# EAGLE design LUZES_18Fv3 (EAGLE 5.10)
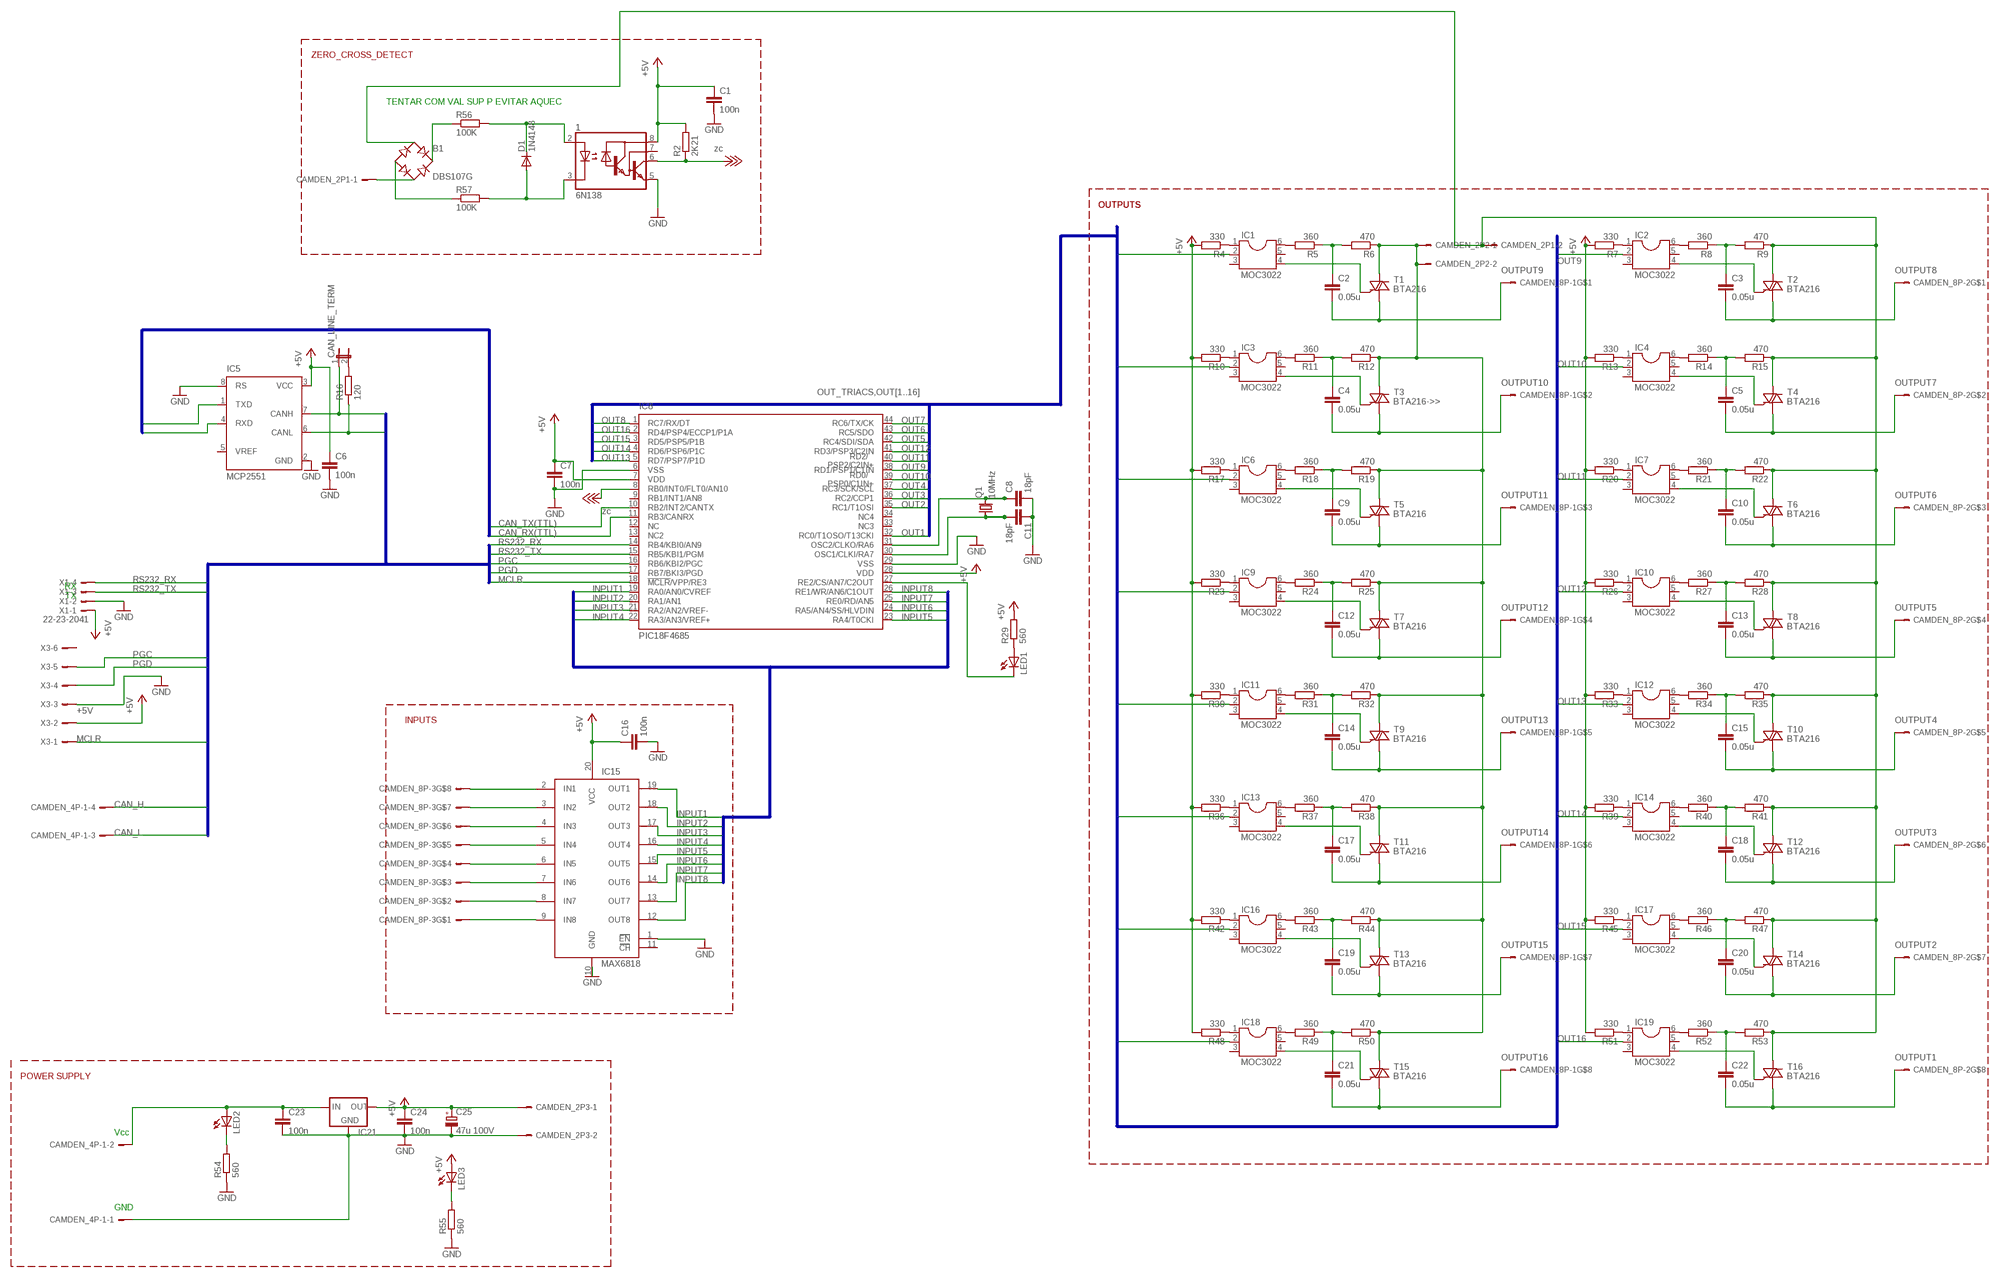
[diagram p0: schematic, sheet 1]

## Parts
1  6N138  6N138SMD  [DIL8-SMD]
B1  DBS107G  [DBS]
C1  100n  C-EUC0805  [C0805]
C2  0.05u  C-EU102-043X133  [C102-043X133]
C3  0.05u  C-EU102-043X133  [C102-043X133]
C4  0.05u  C-EU102-043X133  [C102-043X133]
C5  0.05u  C-EU102-043X133  [C102-043X133]
C6  100n  C-EUC0805  [C0805]
C7  100n  C-EUC0805  [C0805]
C8  18pF  C-EUC0805  [C0805]
C9  0.05u  C-EU102-043X133  [C102-043X133]
C10  0.05u  C-EU102-043X133  [C102-043X133]
C11  18pF  C-EUC0805  [C0805]
C12  0.05u  C-EU102-043X133  [C102-043X133]
C13  0.05u  C-EU102-043X133  [C102-043X133]
C14  0.05u  C-EU102-043X133  [C102-043X133]
C15  0.05u  C-EU102-043X133  [C102-043X133]
C16  100n  C-EUC0805  [C0805]
C17  0.05u  C-EU102-043X133  [C102-043X133]
C18  0.05u  C-EU102-043X133  [C102-043X133]
C19  0.05u  C-EU102-043X133  [C102-043X133]
C20  0.05u  C-EU102-043X133  [C102-043X133]
C21  0.05u  C-EU102-043X133  [C102-043X133]
C22  0.05u  C-EU102-043X133  [C102-043X133]
C23  100n  C-EUC0805  [C0805]
C24  100n  C-EUC0805  [C0805]
C25  47u 100V  CPOL-EUE5-13  [E5-13]
CAMDEN_2P1  CTB9550-2508  [508_2]
CAMDEN_2P2  CTB9550-2508  [508_2]
CAMDEN_2P3  CTB9550-2508  [508_2]
CAMDEN_4P-1  CTB9550-4508  [508_4]
CAMDEN_8P-1  CTB9550-8508  [508_8]
CAMDEN_8P-2  CTB9550-8508  [508_8]
CAMDEN_8P-3  CTB9550-8508  [508_8]
CAN_LINE_TERM  JP1E  [JP1]
D1  1N4148  [DO35-10]
IC1  MOC3022  DIL6  [DIL06]
IC2  MOC3022  DIL6  [DIL06]
IC3  MOC3022  DIL6  [DIL06]
IC4  MOC3022  DIL6  [DIL06]
IC5  MCP2551  PCA82C250T  [SO8]
IC6  MOC3022  DIL6  [DIL06]
IC7  MOC3022  DIL6  [DIL06]
IC8  PIC18F4685  PIC18F4682_85TQFP  [TQFP44@1]
IC9  MOC3022  DIL6  [DIL06]
IC10  MOC3022  DIL6  [DIL06]
IC11  MOC3022  DIL6  [DIL06]
IC12  MOC3022  DIL6  [DIL06]
IC13  MOC3022  DIL6  [DIL06]
IC14  MOC3022  DIL6  [DIL06]
IC15  MAX6818  MAX6818SMALL  [SSOP20_SMALL]
IC16  MOC3022  DIL6  [DIL06]
IC17  MOC3022  DIL6  [DIL06]
IC18  MOC3022  DIL6  [DIL06]
IC19  MOC3022  DIL6  [DIL06]
IC21  78XXS  [78XXS]
LED1  LEDCHIP-LED0805  [CHIP-LED0805]
LED2  LEDCHIP-LED0805  [CHIP-LED0805]
LED3  LEDCHIP-LED0805  [CHIP-LED0805]
Q1  10MHz  CRYSTALHC49U-V  [HC49U-V]
R2  2K21  R-EU_M0805  [M0805]
R4  330  R-EU_M0805  [M0805]
R5  360  R-EU_R0805  [R0805]
R6  470  R-EU_R0805  [R0805]
R7  330  R-EU_M0805  [M0805]
R8  360  R-EU_R0805  [R0805]
R9  470  R-EU_R0805  [R0805]
R10  330  R-EU_M0805  [M0805]
R11  360  R-EU_R0805  [R0805]
R12  470  R-EU_R0805  [R0805]
R13  330  R-EU_M0805  [M0805]
R14  360  R-EU_R0805  [R0805]
R15  470  R-EU_R0805  [R0805]
R16  120  R-EU_M0805  [M0805]
R17  330  R-EU_M0805  [M0805]
R18  360  R-EU_R0805  [R0805]
R19  470  R-EU_R0805  [R0805]
R20  330  R-EU_M0805  [M0805]
R21  360  R-EU_R0805  [R0805]
R22  470  R-EU_R0805  [R0805]
R23  330  R-EU_M0805  [M0805]
R24  360  R-EU_R0805  [R0805]
R25  470  R-EU_R0805  [R0805]
R26  330  R-EU_M0805  [M0805]
R27  360  R-EU_R0805  [R0805]
R28  470  R-EU_R0805  [R0805]
R29  560  R-EU_R0805  [R0805]
R30  330  R-EU_M0805  [M0805]
R31  360  R-EU_R0805  [R0805]
R32  470  R-EU_R0805  [R0805]
R33  330  R-EU_M0805  [M0805]
R34  360  R-EU_R0805  [R0805]
R35  470  R-EU_R0805  [R0805]
R36  330  R-EU_M0805  [M0805]
R37  360  R-EU_R0805  [R0805]
R38  470  R-EU_R0805  [R0805]
R39  330  R-EU_M0805  [M0805]
R40  360  R-EU_R0805  [R0805]
R41  470  R-EU_R0805  [R0805]
R42  330  R-EU_M0805  [M0805]
R43  360  R-EU_R0805  [R0805]
R44  470  R-EU_R0805  [R0805]
R45  330  R-EU_M0805  [M0805]
R46  360  R-EU_R0805  [R0805]
R47  470  R-EU_R0805  [R0805]
R48  330  R-EU_M0805  [M0805]
R49  360  R-EU_R0805  [R0805]
R50  470  R-EU_R0805  [R0805]
R51  330  R-EU_M0805  [M0805]
R52  360  R-EU_R0805  [R0805]
R53  470  R-EU_R0805  [R0805]
R54  560  R-EU_R0805  [R0805]
R55  560  R-EU_R0805  [R0805]
R56  100K  R-EU_R2512  [R2512]
R57  100K  R-EU_R2512  [R2512]
T1  BTA216  TIC225S  [TO220DS]
T2  BTA216  TIC225S  [TO220DS]
T3  BTA216->>  TIC225S  [TO220DS]
T4  BTA216  TIC225S  [TO220DS]
T5  BTA216  TIC225S  [TO220DS]
T6  BTA216  TIC225S  [TO220DS]
T7  BTA216  TIC225S  [TO220DS]
T8  BTA216  TIC225S  [TO220DS]
T9  BTA216  TIC225S  [TO220DS]
T10  BTA216  TIC225S  [TO220DS]
T11  BTA216  TIC225S  [TO220DS]
T12  BTA216  TIC225S  [TO220DS]
T13  BTA216  TIC225S  [TO220DS]
T14  BTA216  TIC225S  [TO220DS]
T15  BTA216  TIC225S  [TO220DS]
T16  BTA216  TIC225S  [TO220DS]
X1  22-23-2041  [22-23-2041]
X3  22-23-2061  [22-23-2061]

## Nets
+5V: 1.8(VCC) C1.1 C6.1 C7.1 C16.1 C24.1 C25.+ CAMDEN_2P3.P$1 IC5.3(VCC) IC8.7(VDD) IC8.28(VDD) IC15.20(VCC) IC21.OUT LED3.A R2.2 R4.2 R7.2 R10.2 R13.2 R17.2 R20.2 R23.2 R26.2 R29.2 R30.2 R33.2 R36.2 R39.2 R42.2 R45.2 R48.2 R51.2 X1.1 X3.2
+18V: 1.6(VO) IC8.8(RB0/INT0/FLT0/AN10) R2.1 ; supply symbol labelled zc
CAN_H: CAMDEN_4P-1.P$4 CAN_LINE_TERM.1 IC5.7(CANH)
CAN_L: CAMDEN_4P-1.P$3 IC5.6(CANL) R16.1
CAN_RX(TTL): IC5.4(RXD) IC8.11(RB3/CANRX)
CAN_TX(TTL): IC5.1(TXD) IC8.10(RB2/INT2/CANTX)
GND: 1.5(GND) C1.2 C6.2 C7.2 C8.2 C11.1 C16.2 C23.2 C24.2 C25.- CAMDEN_2P3.P$2 CAMDEN_4P-1.P$1 IC5.2(GND) IC5.8(RS) IC8.6(VSS) IC8.29(VSS) IC15.1(EN) IC15.10(GND) IC21.GND R54.1 R55.1 X1.2 X3.3
INPUT1: IC8.19(RA0/AN0/CVREF) IC15.19(OUT1)
INPUT2: IC8.20(RA1/AN1) IC15.18(OUT2)
INPUT3: IC8.21(RA2/AN2/VREF-) IC15.17(OUT3)
INPUT4: IC8.22(RA3/AN3/VREF+) IC15.16(OUT4)
INPUT5: IC8.23(RA4/T0CKI) IC15.15(OUT5)
INPUT6: IC8.24(RA5/AN4/SS/HLVDIN) IC15.14(OUT6)
INPUT7: IC8.25(RE0/RD/AN5) IC15.13(OUT7)
INPUT8: IC8.26(RE1/WR/AN6/C1OUT) IC15.12(OUT8)
MCLR: IC8.18(!MCLR!/VPP/RE3) X3.1
N$1: C8.1 IC8.31(OSC2/CLKO/RA6) Q1.2
N$2: C11.2 IC8.30(OSC1/CLKI/RA7) Q1.1
N$3: B1.AC1 CAMDEN_2P1.P$2 R9.1 R15.1 R22.1 R28.1 R35.1 R41.1 R47.1 R53.1 T2.A2 T4.A2 T6.A2 T8.A2 T10.A2 T12.A2 T14.A2 T16.A2
N$4: B1.AC2 CAMDEN_2P1.P$1
N$5: B1.+ R56.1
N$6: CAMDEN_8P-3.P$9 IC15.2(IN1)
N$7: CAMDEN_8P-3.P$7 IC15.3(IN2)
N$8: CAMDEN_8P-3.P$1 IC15.9(IN8)
N$9: CAMDEN_8P-3.P$2 IC15.8(IN7)
N$10: CAMDEN_8P-3.P$3 IC15.7(IN6)
N$11: CAMDEN_8P-3.P$6 IC15.4(IN3)
N$12: CAMDEN_8P-3.P$5 IC15.5(IN4)
N$13: CAMDEN_8P-3.P$4 IC15.6(IN5)
N$16: IC3.6 R11.2
N$17: IC6.6 R18.2
N$18: IC9.6 R24.2
N$20: IC2.6 R8.2
N$25: IC4.6 R14.2
N$27: IC11.6 R31.2
N$29: IC13.6 R37.2
N$30: IC16.6 R43.2
N$33: IC17.6 R46.2
N$34: IC14.6 R40.2
N$35: IC12.6 R34.2
N$36: IC10.6 R27.2
N$37: IC7.6 R21.2
N$38: LED1.A R29.1
N$39: IC8.27(RE2/CS/AN7/C2OUT) LED1.C
N$40: IC18.6 R49.2
N$41: IC19.6 R52.2
N$46: CAMDEN_2P2.P$1 CAMDEN_2P2.P$2 R6.1 R12.1 R19.1 R25.1 R32.1 R38.1 R44.1 R50.1 T1.A2 T3.A2 T5.A2 T7.A2 T9.A2 T11.A2 T13.A2 T15.A2
N$111: C23.1 CAMDEN_4P-1.P$2 IC21.IN LED2.A
N$112: LED2.C R54.2
N$115: LED3.C R55.2
N$116: 1.2(A) D1.C R56.2
N$117: B1.- R57.1
N$118: 1.3(C) D1.A R57.2
N$119: IC1.1 R4.1
N$120: IC1.6 R5.2
N$121: C2.1 R5.1 R6.2
N$123: IC1.4 T1.G
N$125: IC3.1 R10.1
N$127: C4.1 R11.1 R12.2
N$129: IC3.4 T3.G
N$131: IC6.1 R17.1
N$133: C9.1 R18.1 R19.2
N$135: IC6.4 T5.G
N$137: IC9.1 R23.1
N$139: C12.1 R24.1 R25.2
N$141: IC9.4 T7.G
N$143: IC11.1 R30.1
N$145: C14.1 R31.1 R32.2
N$147: IC11.4 T9.G
N$149: IC13.1 R36.1
N$151: C17.1 R37.1 R38.2
N$153: IC13.4 T11.G
N$155: IC16.1 R42.1
N$157: C19.1 R43.1 R44.2
N$159: IC16.4 T13.G
N$161: IC18.1 R48.1
N$163: C21.1 R49.1 R50.2
N$165: IC18.4 T15.G
N$168: IC2.1 R7.1
N$170: C3.1 R8.1 R9.2
N$172: IC2.4 T2.G
N$174: IC4.1 R13.1
N$176: C5.1 R14.1 R15.2
N$178: IC4.4 T4.G
N$180: IC7.1 R20.1
N$182: C10.1 R21.1 R22.2
N$184: IC7.4 T6.G
N$186: IC10.1 R26.1
N$188: C13.1 R27.1 R28.2
N$190: IC10.4 T8.G
N$192: IC12.1 R33.1
N$194: C15.1 R34.1 R35.2
N$196: IC12.4 T10.G
N$198: IC14.1 R39.1
N$200: C18.1 R40.1 R41.2
N$202: IC14.4 T12.G
N$204: IC17.1 R45.1
N$206: C20.1 R46.1 R47.2
N$208: IC17.4 T14.G
N$210: IC19.1 R51.1
N$212: C22.1 R52.1 R53.2
N$214: IC19.4 T16.G
N$217: CAN_LINE_TERM.2 R16.2
OUT1: IC8.32(RC0/T1OSO/T13CKI) IC18.2
OUT2: IC8.35(RC1/T1OSI) IC16.2
OUT3: IC8.36(RC2/CCP1) IC13.2
OUT4: IC8.37(RC3/SCK/SCL) IC11.2
OUT5: IC8.42(RC4/SDI/SDA) IC9.2
OUT6: IC6.2 IC8.43(RC5/SDO)
OUT7: IC3.2 IC8.44(RC6/TX/CK)
OUT8: IC1.2 IC8.1(RC7/RX/DT)
OUT9: IC2.2 IC8.38(RD1/PSP1/C1IN)
OUT10: IC4.2 IC8.39(RD0/
PSP0/C1IN+)
OUT11: IC7.2 IC8.40(RD2/
PSP2/C2IN+)
OUT12: IC8.41(RD3/PSP3/C2IN) IC10.2
OUT13: IC8.5(RD7/PSP7/P1D) IC12.2
OUT14: IC8.4(RD6/PSP6/P1C) IC14.2
OUT15: IC8.3(RD5/PSP5/P1B) IC17.2
OUT16: IC8.2(RD4/PSP4/ECCP1/P1A) IC19.2
OUTPUT1: C22.2 CAMDEN_8P-2.P$9 T16.A1
OUTPUT2: C20.2 CAMDEN_8P-2.P$7 T14.A1
OUTPUT3: C18.2 CAMDEN_8P-2.P$6 T12.A1
OUTPUT4: C15.2 CAMDEN_8P-2.P$5 T10.A1
OUTPUT5: C13.2 CAMDEN_8P-2.P$4 T8.A1
OUTPUT6: C10.2 CAMDEN_8P-2.P$3 T6.A1
OUTPUT7: C5.2 CAMDEN_8P-2.P$2 T4.A1
OUTPUT8: C3.2 CAMDEN_8P-2.P$1 T2.A1
OUTPUT9: C2.2 CAMDEN_8P-1.P$1 T1.A1
OUTPUT10: C4.2 CAMDEN_8P-1.P$2 T3.A1
OUTPUT11: C9.2 CAMDEN_8P-1.P$3 T5.A1
OUTPUT12: C12.2 CAMDEN_8P-1.P$4 T7.A1
OUTPUT13: C14.2 CAMDEN_8P-1.P$5 T9.A1
OUTPUT14: C17.2 CAMDEN_8P-1.P$6 T11.A1
OUTPUT15: C19.2 CAMDEN_8P-1.P$7 T13.A1
OUTPUT16: C21.2 CAMDEN_8P-1.P$9 T15.A1
PGC: IC8.16(RB6/KBI2/PGC) X3.5
PGD: IC8.17(RB7/BKI3/PGD) X3.4
RS232_RX: IC8.14(RB4/KBI0/AN9) X1.4
RS232_TX: IC8.15(RB5/KBI1/PGM) X1.3
Unconnected: 1.7(VB) IC1.3 IC1.5 IC2.3 IC2.5 IC3.3 IC3.5 IC4.3 IC4.5 IC5.5(VREF) IC6.3 IC6.5 IC7.3 IC7.5 IC8.9(RB1/INT1/AN8) IC8.12(NC) IC8.13(NC2) IC8.33(NC3) IC8.34(NC4) IC9.3 IC9.5 IC10.3 IC10.5 IC11.3 IC11.5 IC12.3 IC12.5 IC13.3 IC13.5 IC14.3 IC14.5 IC15.11(CH) IC16.3 IC16.5 IC17.3 IC17.5 IC18.3 IC18.5 IC19.3 IC19.5 X3.6

## Buses
OUT_TRIACS,OUT[1..16]
INPUTS,INPUT[1..8]
EXT_CON,+12,GND,RS232_RX,RS232_TX,CAN_L,CAN_H,MCLR,PGD,PGC
CAN_TX(TTL),CAN_RX(TTL)

## Notes on the sheet
- ZERO_CROSS_DETECT
- TENTAR COM VAL SUP P EVITAR AQUEC
- OUTPUTS | OUTPUTS
- RX
- TX
- INPUTS
- POWER SUPPLY
- Vcc
- GND

## Library data of the parts
1 = optocoupler:6N138: MOTOROLA OPTO COUPLER
B1 = rectifier:DB?*G: Single Phase 1.0 AMP Glass Passivated Bridge Rectifier Taiwan Semiconductor Co.,Ltd. - TSC Source: http://www.taiwansemi.com/TSCbig5/ezcatfiles/cust/img/img/db101g.pdf http://www.ts.com.tw/db/pictures/modules/PDT/PDT060207001/DBLS201G.pdf
C1-C24 = rcl:C-EU: CAPACITOR, European symbol
C25 = rcl:CPOL-EU: POLARIZED CAPACITOR, European symbol
CAMDEN_2P1-CAMDEN_2P3 = mycomponents:CTB9550-2
CAMDEN_4P-1 = mycomponents:CTB9550-4
CAMDEN_8P-1-CAMDEN_8P-3 = mycomponents:CTB9550-8
CAN_LINE_TERM = jumper:JP1E: JUMPER
D1 = diode:1N4148: DIODE high speed (Philips)
IC1-IC4 IC6 IC7 IC9-IC14 IC16-IC19 = ic-package:DIL6: Dual In Line
IC5 = micro-philips:PCA82C250: CAN CONTROLLER INTERFACE
IC8 = microchip:PIC18F4682_85TQFP
IC15 = maxim:MAX6818
IC21 = v-reg:78XXS: VOLTAGE REGULATOR
LED1-LED3 = led:LED: LED OSRAM: - CHIPLED LG R971, LG N971, LY N971, LG Q971, LY Q971, LO R971, LY R971 LH N974, LH R974 LS Q976, LO Q976, LY Q976 LO Q996 - Hyper CHIPLED LW Q18S LB Q993, LB Q99A, LB R99A - SideLED LS A670, LO A670, LY A670, LG A670, LP A670 LB A673, LV A673, LT A673, LW A673 LH A674 LY A675 LS A676, LA A676, LO A676, LY A676, LW A676 LS A679, LY A679, LG A679 - Hyper Micro SIDELED? LS Y876, LA Y876, LO Y876, LY Y876 LT Y87S - SmartLED LW L88C, LW L88S LB L89C, LB L89S, LG L890 LS L89K, LO L89K, LY L89K LS L896, LA L896, LO L896, LY L896 - TOPLED LS T670, LO T670, LY T670, LG T670, LP T670 LSG T670, LSP T670, LSY T670, LOP T670, LYG T670 LG T671, LOG T671, LSG T671 LB T673, LV T673, LT T673, LW T673 LH T674 LS T676, LA T676, LO T676, LY T676, LB T676, LH T676, LSB T676, LW T676 LB T67C, LV T67C, LT T67C, LS T67K, LO T67K, LY T67K, LW E67C LS E67B, LA E67B, LO E67B, LY E67B, LB E67C, LV E67C, LT E67C LW T67C LS T679, LY T679, LG T679 LS T770, LO T770, LY T770, LG T770, LP T770 LB T773, LV T773, LT T773, LW T773 LH T774 LS E675, LA E675, LY E675, LS T675 LS T776, LA T776, LO T776, LY T776, LB T776 LHGB T686 LT T68C, LB T68C - Hyper Mini TOPLED? LB M676 - Mini TOPLED Santana? LG M470 LS M47K, LO M47K, LY M47K Source: http://www.osram.convergy.de/
Q1 = crystal:CRYSTAL: CRYSTAL
R2 R4-R57 = rcl:R-EU_: RESISTOR, European symbol
T1-T16 = triac:TIC225S: TRIAC
X1 = con-molex:22-23-2041: .100" (2.54mm) Center Header - 4 Pin
X3 = con-molex:22-23-2061: .100" (2.54mm) Center Header - 6 Pin

## Board
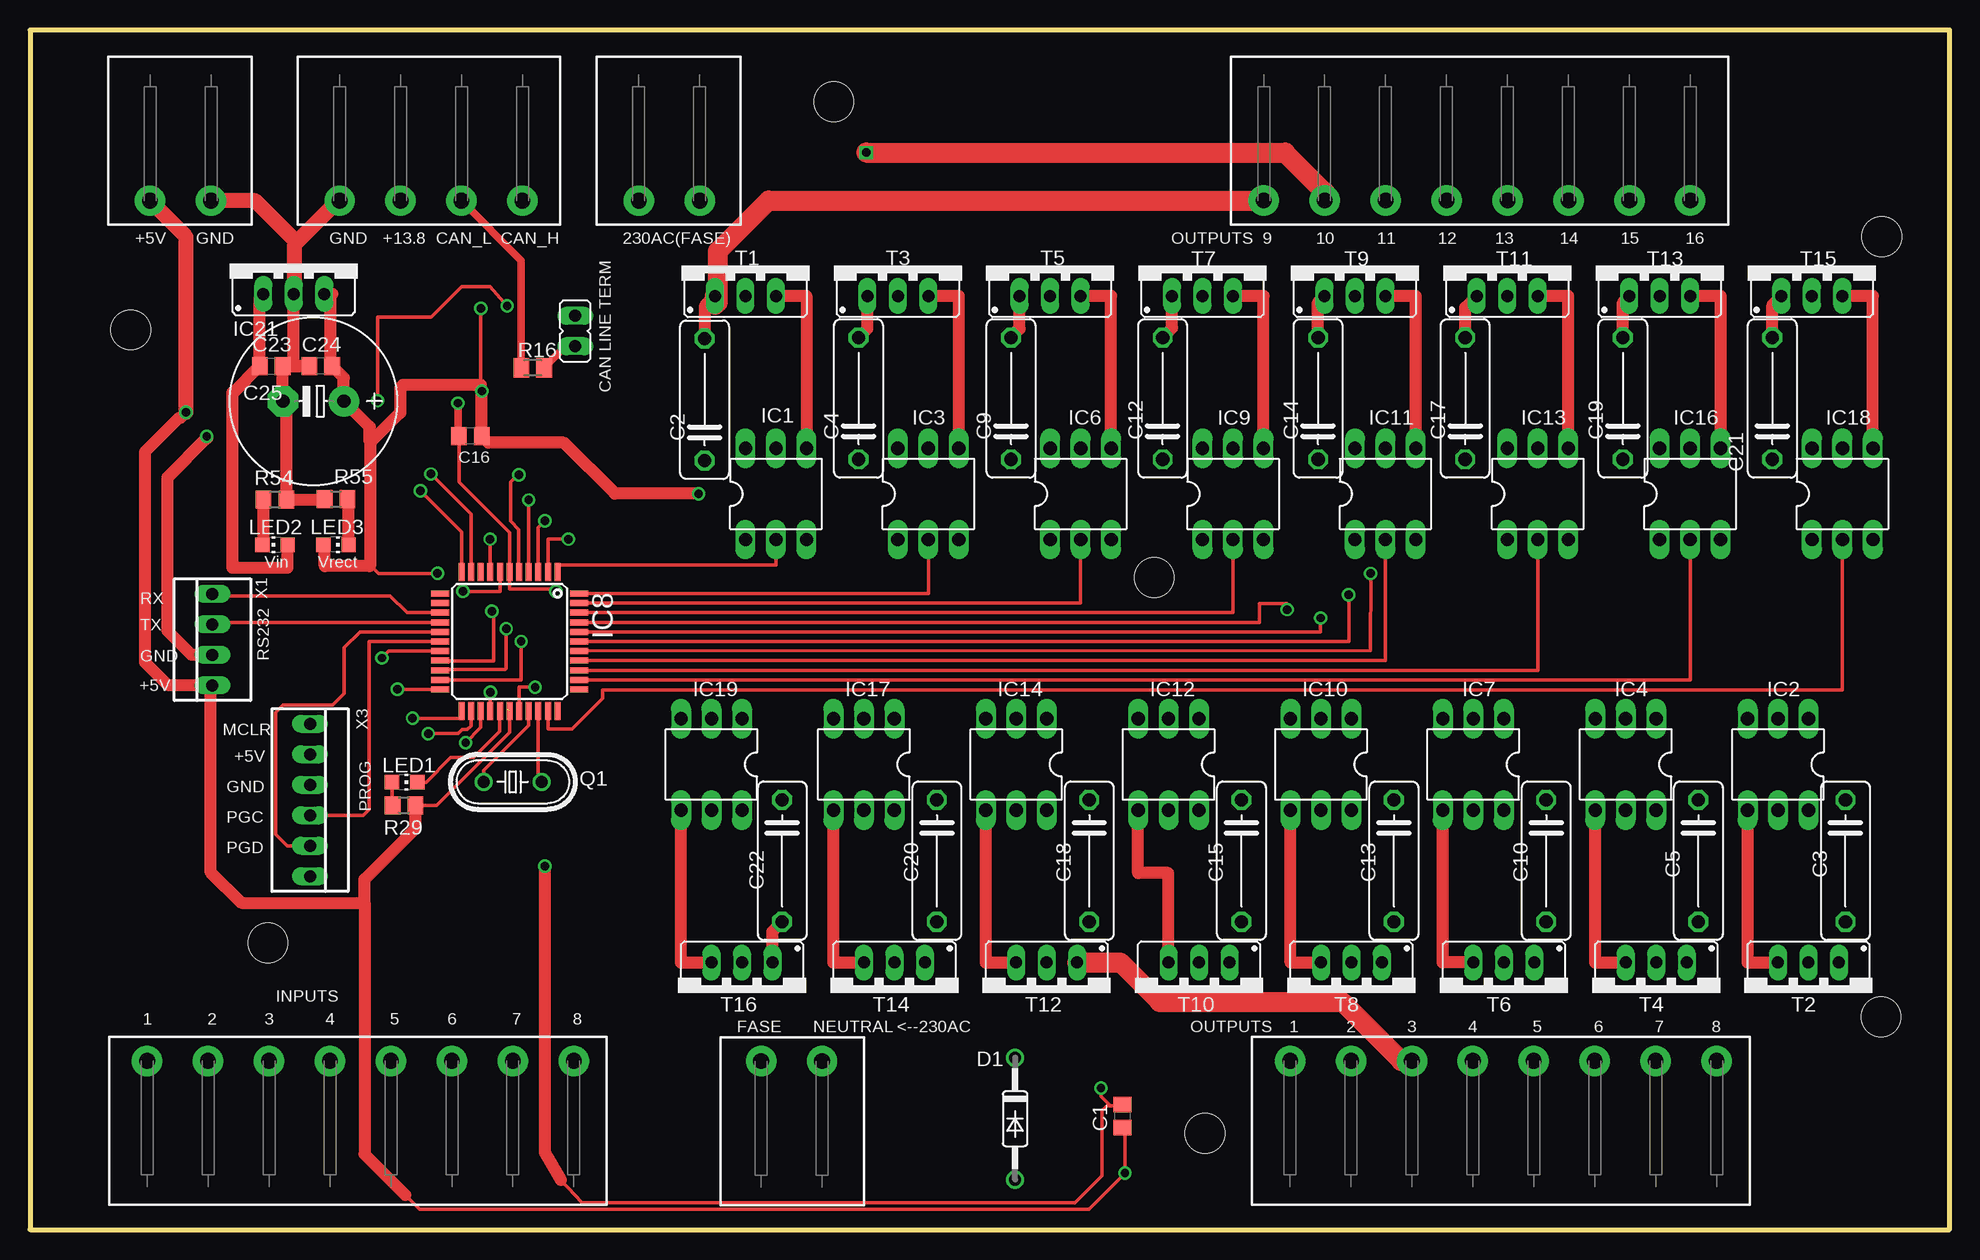
[diagram p1: board, top side]
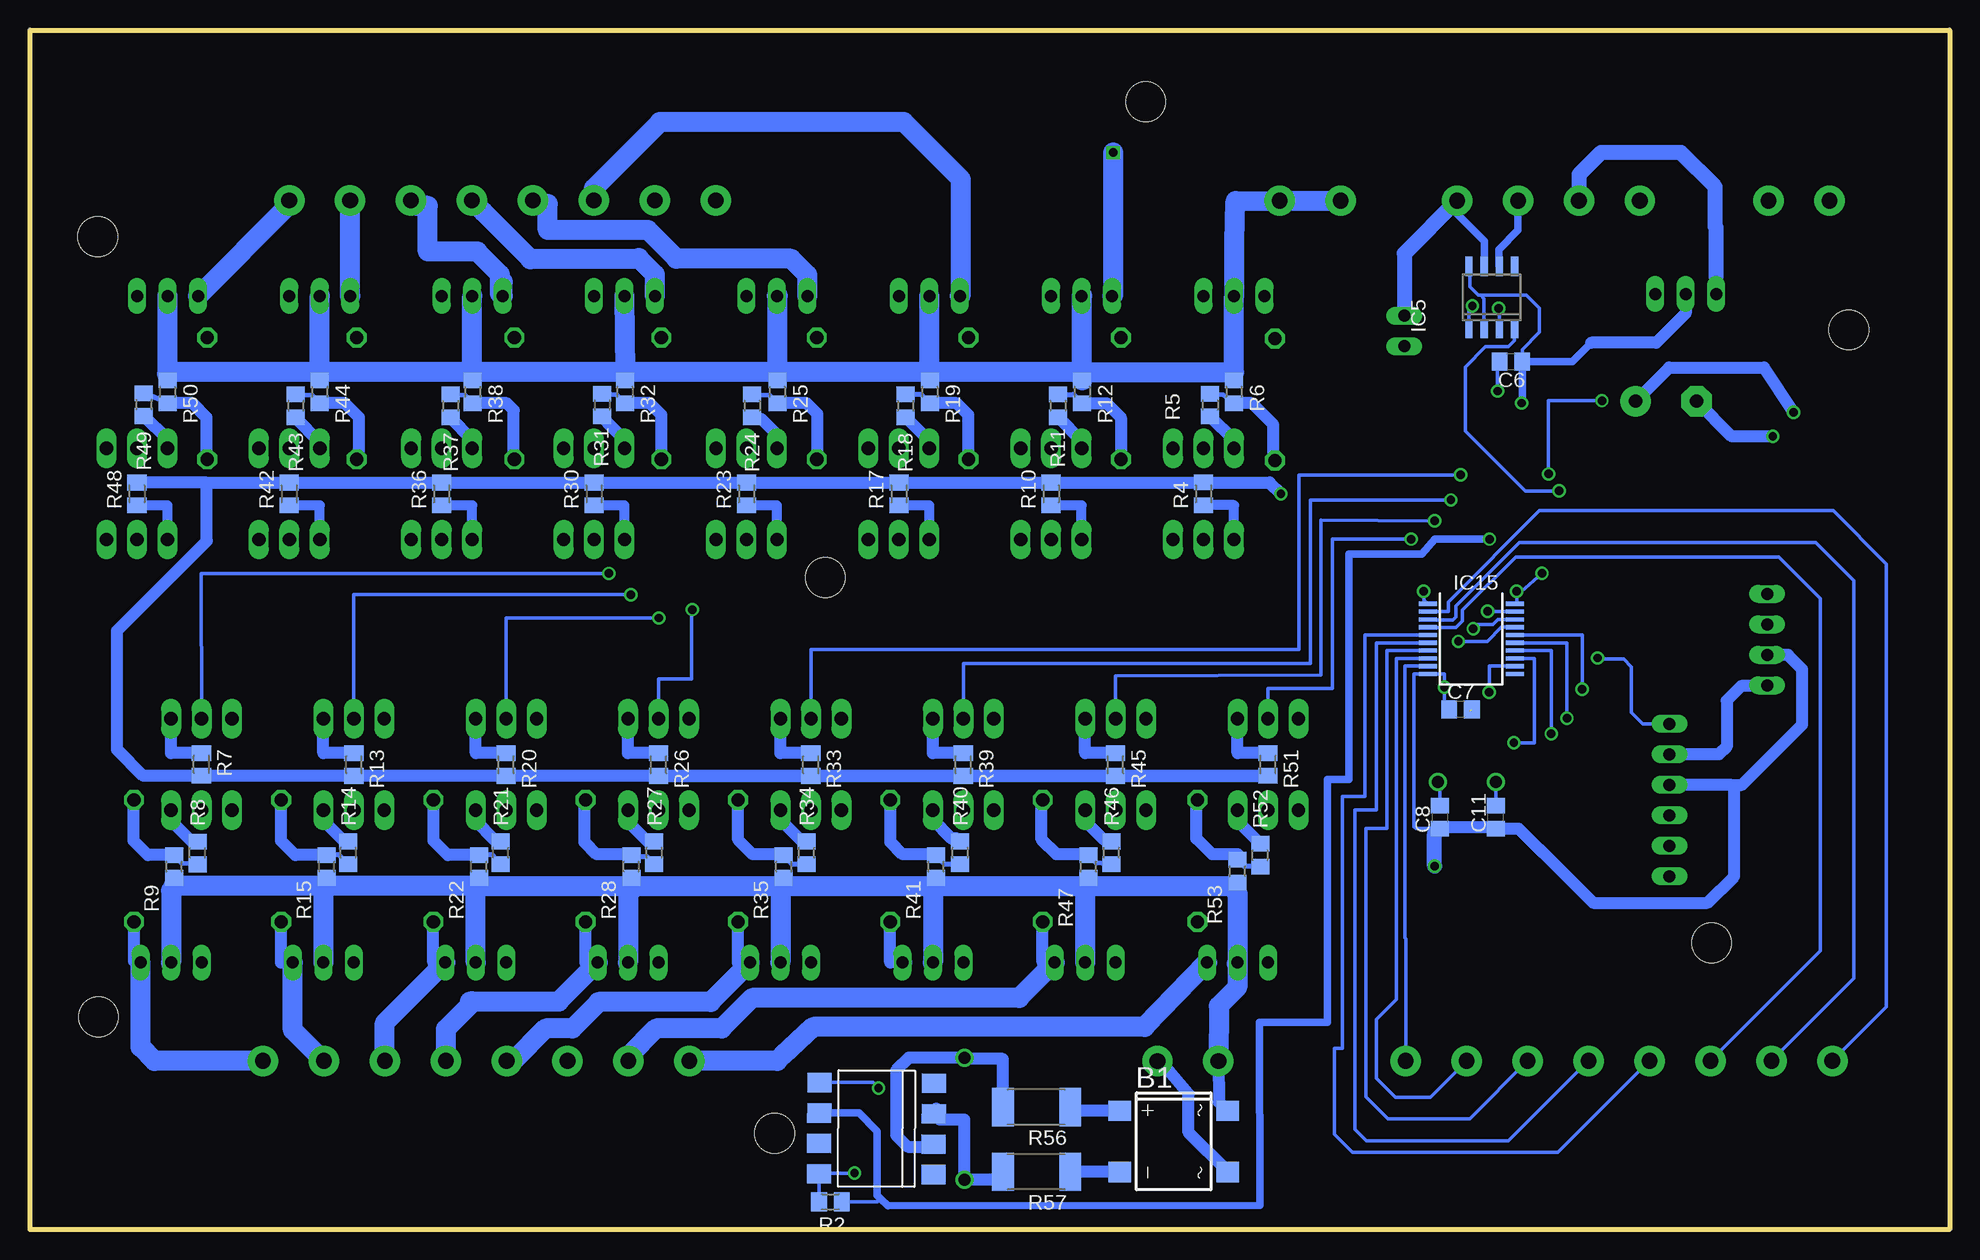
[diagram p2: board, bottom side, seen from below]

Size 160 x 100 mm. Coordinates in mm from the lower left corner, seen from the top.
Outline: 0,100 0,0 160,0 160,100 0,100
Copper layers (1*16): Top 0.035mm / dielectric 1.5mm / Bottom 0.035mm
Design rules "10mils": minimum track width 10mil, minimum drill 24mil, track to track 10mil, track to pad 10mil, pad to pad 10mil, via to via 10mil, smd to smd 10mil, copper to edge 40mil, drill to drill 10mil, minimum pad ring 10mil, minimum via ring 8mil, stop-mask expansion 0mil, vias tented up to drill 0mil, thermal gap 10mil
Holes 3.3 mm at 19.83,23.89 8.39,75 93.71,54.36 67,94.03 154.34,82.76 154.29,17.72 97.94,8.02

### Footprints (pad centres in the part's own frame; a part is rotated, then mirrored left to right if it is on the bottom)
DIL8-SMD = smd 1.6 x 2: 1 -3.81,-4.77; 2 -1.27,-4.77; 3 1.27,-4.77; 4 3.81,-4.77; 5 3.81,4.77; 6 1.27,4.77; 7 -1.27,4.77; 8 -3.81,4.77
DBS = smd 1.7 x 1.9: + -2.55,-4.5; - 2.55,-4.5; AC1 -2.55,4.5; AC2 2.55,4.5
C0805 = smd 1.3 x 1.5: 1 -0.95,0; 2 0.95,0
C102-043X133 = drill 1.1 octagon: 1 -5.08,0; 2 5.08,0
E5-13 = drill 1.1 pad 2.54 round: + -2.54,0 | drill 1.1 pad 2.54 octagon: - 2.54,0
508_2 = drill 1.3 pad 2.54 round: P$1 -3.81,-5.08; P$2 1.27,-5.08
508_4 = drill 1.3 pad 2.54 round: P$1 -7.62,-5.08; P$2 -2.54,-5.08; P$3 2.54,-5.08; P$4 7.62,-5.08
508_8 = drill 1.3 pad 2.54 round: P$1 -17.78,-5.08; P$2 -12.7,-5.08; P$3 -7.62,-5.08; P$4 -2.54,-5.08; P$5 2.54,-5.08; P$6 7.62,-5.08; P$7 12.7,-5.08; P$9 17.78,-5.08
JP1 = drill 1 long: 1 0,-1.27; 2 0,1.27
DO35-10 = drill 1 round: A 5.08,0; C -5.08,0
DIL06 = drill 1.1 long: 1 -2.54,-3.81; 2 0,-3.81; 3 2.54,-3.81; 4 2.54,3.81; 5 0,3.81; 6 -2.54,3.81
SO8 = smd 0.6 x 1.6: 1 -1.905,-2.6; 2 -0.635,-2.6; 3 0.635,-2.6; 4 1.905,-2.6; 5 1.905,2.6; 6 0.635,2.6; 7 -0.635,2.6; 8 -1.905,2.6
TQFP44@1 = smd 1.5 x 0.5: 1 -5.8,4; 2 -5.8,3.2; 3 -5.8,2.4; 4 -5.8,1.6; 5 -5.8,0.8; 6 -5.8,0; 7 -5.8,-0.8; 8 -5.8,-1.6; 9 -5.8,-2.4; 10 -5.8,-3.2; 11 -5.8,-4; 23 5.8,-4; 24 5.8,-3.2; 25 5.8,-2.4; 26 5.8,-1.6; 27 5.8,-0.8; 28 5.8,0; 29 5.8,0.8; 30 5.8,1.6; 31 5.8,2.4; 32 5.8,3.2; 33 5.8,4 | smd 0.5 x 1.5: 12 -4,-5.8; 13 -3.2,-5.8; 14 -2.4,-5.8; 15 -1.6,-5.8; 16 -0.8,-5.8; 17 0,-5.8; 18 0.8,-5.8; 19 1.6,-5.8; 20 2.4,-5.8; 21 3.2,-5.8; 22 4,-5.8; 34 4,5.8; 35 3.2,5.8; 36 2.4,5.8; 37 1.6,5.8; 38 0.8,5.8; 39 0,5.8; 40 -0.8,5.8; 41 -1.6,5.8; 42 -2.4,5.8; 43 -3.2,5.8; 44 -4,5.8
SSOP20_SMALL = smd 0.349 x 1.5: 1 -2.925,-3.625; 2 -2.275,-3.625; 3 -1.625,-3.625; 4 -0.975,-3.625; 5 -0.325,-3.625; 6 0.325,-3.625; 7 0.975,-3.625; 8 1.625,-3.625; 9 2.275,-3.625; 10 2.925,-3.625; 11 2.925,3.625; 12 2.275,3.625; 13 1.625,3.625; 14 0.975,3.625; 15 0.325,3.625; 16 -0.325,3.625; 17 -0.975,3.625; 18 -1.625,3.625; 19 -2.275,3.625; 20 -2.925,3.625
78XXS = drill 1 long: GND 0,-2.54; IN -2.54,-2.54; OUT 2.54,-2.54
CHIP-LED0805 = smd 1.2 x 1.2: A 0,-1.05; C 0,1.05
HC49U-V = drill 1 round: 1 -2.413,0; 2 2.413,0
M0805 = smd 1.3 x 1.6: 1 -0.95,0; 2 0.95,0
R0805 = smd 1.3 x 1.5: 1 -0.95,0; 2 0.95,0
R2512 = smd 1.8 x 3.2: 1 -2.8,0; 2 2.8,0
TO220DS = drill 1 long: A1 -2.54,-2.54; A2 0,-2.54; G 2.54,-2.54
22-23-2041 = drill 1 long: 1 -3.81,0; 2 -1.27,0; 3 1.27,0; 4 3.81,0
22-23-2061 = drill 1 long: 1 -6.35,0; 2 -3.81,0; 3 -1.27,0; 4 1.27,0; 5 3.81,0; 6 6.35,0

### Placement (x,y rotation side)
1  89.44,8.42 89.7 bottom
B1  64.67,7.35 270 bottom
C1  91.08,9.46 90 top
C2  56.24,69.18 90 top
C3  151.33,30.74 270 top
C4  69.06,69.28 90 top
C5  139.07,30.74 270 top
C6  36.56,72.36 0 bottom
C7  40.76,43.36 180 bottom
C8  42.49,34.37 270 bottom
C9  81.78,69.28 90 top
C10  126.38,30.74 270 top
C11  37.83,34.37 90 bottom
C12  94.42,69.28 90 top
C13  113.69,30.74 270 top
C14  107.37,69.28 90 top
C15  100.98,30.74 270 top
C16  36.7,66.16 180 top
C17  119.63,69.28 90 top
C18  88.29,30.74 270 top
C19  132.78,69.28 90 top
C20  75.59,30.74 270 top
C21  145.23,69.28 90 top
C22  62.7,30.74 270 top
C23  20.11,71.99 0 top
C24  24.24,71.99 180 top
C25  23.62,69.06 180 top
CAMDEN_2P1  62.21,8.96 180 top
CAMDEN_2P2  54.56,90.85 0 top
CAMDEN_2P3  13.82,90.85 0 top
CAMDEN_4P-1  33.43,90.85 0 top
CAMDEN_8P-1  120.61,90.86 0 top
CAMDEN_8P-2  122.81,8.98 180 top
CAMDEN_8P-3  27.55,8.98 180 top
CAN_LINE_TERM  45.45,74.9 180 top
D1  82.11,9.24 270 top
DRILEGEND  [DRILEGEND]  -0.23,-5.5 0 top  (outside the outline)
IC1  62.18,61.32 0 top
IC2  145.71,38.77 180 top
IC3  74.88,61.32 0 top
IC4  133.01,38.77 180 top
IC5  38.16,77.7 0 bottom
IC6  87.58,61.32 0 top
IC7  120.31,38.77 180 top
IC8  39.97,49.02 270 top
IC9  100.28,61.32 0 top
IC10  107.61,38.77 180 top
IC11  112.98,61.32 0 top
IC12  94.91,38.77 180 top
IC13  125.68,61.32 0 top
IC14  82.21,38.77 180 top
IC15  39.87,49.23 270 bottom
IC16  138.38,61.32 0 top
IC17  69.51,38.77 180 top
IC18  151.08,61.32 0 top
IC19  56.81,38.77 180 top
IC21  21.98,80.53 0 top
LED1  31.23,37.29 270 top
LED2  20.43,57.09 90 top
LED3  25.51,57.09 270 top
Q1  40.24,37.32 0 top
R2  93.28,2.32 180 bottom
R4  62.18,61.33 90 bottom
R5  61.63,68.73 270 bottom
R6  59.64,69.83 270 bottom
R7  145.71,38.77 270 bottom
R8  146.04,31.39 90 bottom
R9  147.97,30.26 90 bottom
R10  74.88,61.32 90 bottom
R11  74.32,68.67 270 bottom
R12  72.29,69.83 270 bottom
R13  133,38.77 270 bottom
R14  133.46,31.41 90 bottom
R15  135.27,30.26 90 bottom
R16  41.91,71.84 0 top
R17  87.57,61.32 90 bottom
R18  87.02,68.67 270 bottom
R19  84.99,69.83 270 bottom
R20  120.31,38.77 270 bottom
R21  120.76,31.41 90 bottom
R22  122.57,30.26 90 bottom
R23  100.28,61.32 90 bottom
R24  99.79,68.67 270 bottom
R25  97.7,69.83 270 bottom
R26  107.6,38.77 270 bottom
R27  107.96,31.41 90 bottom
R28  109.87,30.26 90 bottom
R29  31.18,35.37 0 top
R30  112.98,61.32 90 bottom
R31  112.3,68.73 270 bottom
R32  110.41,69.83 270 bottom
R33  94.91,38.77 270 bottom
R34  95.26,31.41 90 bottom
R35  97.17,30.26 90 bottom
R36  125.69,61.32 90 bottom
R37  124.94,68.67 270 bottom
R38  123.11,69.83 270 bottom
R39  82.2,38.77 270 bottom
R40  82.46,31.41 90 bottom
R41  84.47,30.26 90 bottom
R42  138.39,61.32 90 bottom
R43  137.84,68.67 270 bottom
R44  135.85,69.83 270 bottom
R45  69.51,38.77 270 bottom
R46  69.86,31.41 90 bottom
R47  71.77,30.26 90 bottom
R48  151.08,61.32 90 bottom
R49  150.52,68.77 270 bottom
R50  148.54,69.83 270 bottom
R51  56.81,38.77 270 bottom
R52  57.45,31.21 90 bottom
R53  59.35,29.88 90 bottom
R54  20.42,60.84 180 top
R55  25.51,60.9 0 top
R56  76.1,10.21 180 bottom
R57  76.1,4.81 180 bottom
T1  59.64,80.37 0 top
T2  148.25,19.72 180 top
T3  72.34,80.37 0 top
T4  135.55,19.72 180 top
T5  85.04,80.37 0 top
T6  122.85,19.72 180 top
T7  97.74,80.37 0 top
T8  110.15,19.72 180 top
T9  110.44,80.37 0 top
T10  97.45,19.72 180 top
T11  123.14,80.37 0 top
T12  84.75,19.72 180 top
T13  135.84,80.37 0 top
T14  72.05,19.72 180 top
T15  148.54,80.37 0 top
T16  59.35,19.72 180 top
X1  15.2,49.18 90 top
X3  23.34,35.8 270 top

### Tracks (layer width: path | path; a pad name or v marks a point on that pad's centre or on a via)
+5V  (via drill 0.7, 0.7 pad 1.02)  (1 unrouted)
  Top 0.305: IC8.28 39.98,43.21 39.98,42.18 39.98,42.17 39.98,41.45 33.91,35.37 R29.2 | 31.27,2.88 32.47,1.68 88.25,1.68 v91.27,4.7 91.27,8.32 C1.1 | 37.65,69.88 v37.67,69.9 37.57,70 37.57,70.4 v37.57,76.8 | v36.07,53.2 39.17,53.2 IC8.7 | 28.37,55.4 29.07,54.7 v33.97,54.7
  Top 1.016: C16.1 | v13.01,68.13 12.56,67.68 12.45,67.68 9.57,64.8 9.57,47.3 11.47,45.4 15.18,45.4 X1.1 15.04,45.17 15.04,29.82 17.63,27.23 27.88,27.23 | C16.1 38.21,65.6 44.48,65.6 48.75,61.33 v55.73,61.33 | R29.2 32.13,33.45 27.88,29.2 27.88,27.23 | 27.88,27.23 27.88,6.28 31.27,2.88 | 25.07,77.99 IC21.OUT | 25.07,77.99 25.19,77.99 | C16.1 37.65,69.88 | LED3.A 24.57,56.97 24.57,55.3 28.27,55.3 28.37,55.4 28.37,65.6 | 28.37,65.6 28.31,65.66 28.31,66.91 C25.+ 26.16,71.01 C24.1 25.07,71.99 25.07,77.99 | 28.37,65.6 30.87,68.1 30.87,70.2 31.07,70.4 37.57,70.4
  Top 1.27: CAMDEN_2P3.P$1 13.01,82.77 v13.01,68.13
  Bottom 0.305: v91.27,4.7 94.16,4.7 1.8 R2.2 | v37.67,69.9 37.67,72.2 C6.1 | IC5.3 37.52,76.95 v37.57,76.8 | IC15.20 36.07,52.33 v36.07,53.2 35.67,53.2 v33.97,54.7
  Bottom 0.813: R10.2 74.88,62.28
  Bottom 1.016: 74.88,62.28 R4.2 56.68,62.28 v55.73,61.33 | R10.2 R17.2 R23.2 R30.2 R36.2 R42.2 145.26,62.27 | 145.26,62.27 R48.2 | R20.2 R26.2 R33.2 R39.2 R45.2 R51.2 150.56,37.82 152.74,40.01 152.74,49.93 145.26,57.41 145.26,62.27 | R20.2 | R20.2 R13.2 | R13.2 | R13.2 R7.2 | X3.2 19.21,39.61 18.58,40.25 18.58,44.09 17.37,45.3 15.28,45.3 X1.1 | v13.01,68.13 15.48,71.86 23.36,71.86 C25.+
+18V  (via drill 0.7)
  Top 0.305: IC8.8 38.37,57.53 v38.35,57.56
  Bottom 0.305: R2.1 89.35,2.32 89.1,2.57
  Bottom 0.61: v38.35,57.56 42.91,57.56 43.96,56.3 50.06,56.3 50.06,37.5 51.85,37.5 51.85,17.25 57.52,17.25 57.49,2.01 88.49,1.96 89.1,2.57 89.38,2.86 89.38,8.18 90.91,9.71 1.6
CAN_H
  Bottom 0.61: CAMDEN_4P-1.P$4 41.05,84.68 38.77,82.4 38.77,80.32 IC5.7
  Bottom 1.27: CAN_LINE_TERM.1 45.45,81.37 CAMDEN_4P-1.P$4
CAN_L
  Top 0.61: R16.1 40.96,80.79 CAMDEN_4P-1.P$3
  Bottom 0.61: CAMDEN_4P-1.P$3 35.97,83.3 37.57,81.7 37.57,80.34 IC5.6
CAN_RX(TTL)  (via drill 0.7)
  Top 0.305: IC8.11 35.97,58.16 v32.55,61.58
  Bottom 0.305: v32.55,61.58 35.36,61.58 40.36,66.57 40.36,71.91 38.67,73.6 36.77,73.6 36.27,74.1 36.27,75.08 IC5.4
CAN_TX(TTL)  (via drill 0.7, 0.7 pad 1.02)
  Top 0.305: v33.42,62.98 36.77,59.64 IC8.10 | v39.77,77 38.37,78.6 35.97,78.6 33.42,76.05 28.97,76.05 v28.97,69.1
  Bottom 0.305: IC5.1 40.06,76.91 v39.77,77 | v33.42,62.98 33.42,69.1 v28.97,69.1
GND  (via drill 0.7)
  Top 0.305: v43.82,53.21 43.41,53.38 39.98,53.38 39.97,53.39 IC8.6 39.97,58.12 35.75,62.33 C16.2 35.29,66.62 | v42.1,45.21 40.77,45.21 IC8.29 | 44.26,4.11 46.01,2.25 87.12,2.25 89.37,4.5 89.37,9.9 89.77,10.3 90.07,10.3 | 90.07,10.3 90.96,10.3 C1.2 | v89.27,11.8 89.27,11.1 90.07,10.3
  Top 0.61: v35.67,68.9 35.67,66.24 C16.2
  Top 1.016: 21.82,77.82 IC21.GND 21.98,71.99 C24.2 C23.2 21.08,71.99 C25.- 21.37,69.06 R54.1 24.56,60.84 R55.1 | X1.2 15.76,47.75 | 15.76,47.75 15.9,47.71 | v14.73,66.12 14.79,66.06 14.79,66.01 11.47,62.7 11.47,49.9 13.47,47.9 15.61,47.9 15.76,47.75 | v42.92,30.3 42.92,6.4 44.26,4.11
  Top 1.27: IC21.GND 22.07,78.07 22.07,82.16 22.23,82.32 | CAMDEN_4P-1.P$1 25.69,85.77 22.23,82.32 | CAMDEN_2P3.P$2 18.78,85.77 22.23,82.32
  Bottom 0.305: IC15.1 43.81,52.47 v43.82,53.21 | C7.2 42.1,43.75 v42.1,45.21 42.1,46.31 IC15.10 44.65,46.31 44.65,33.58 44.49,33.42 C8.2 | C11.1 37.8,33.7 | 1.5 89.72,12.25 v89.27,11.8 | C6.2 35.61,73.36 34.17,74.8 34.17,76.8 35.27,77.9 39.07,77.9 | 39.07,77.9 39.27,77.9 39.97,78.6 39.97,80.2 IC5.8 | IC5.2 38.79,77.62 39.07,77.9
  Bottom 0.61: 29.87,73.93 31.44,72.36 C6.2 35.61,68.96 v35.67,68.9
  Bottom 1.016: IC21.GND 21.98,76.39 24.45,73.93 29.87,73.93 | C8.2 42.29,33.56 37.98,33.56 C11.1 35.92,33.43 34.14,31.64 | 18.26,37.07 17.31,37.07 16.04,38.34 16.03,38.34 12.27,42.1 12.27,46.7 13.47,47.9 15.19,47.9 X1.2 | 18.26,37.07 X3.3 | 18.26,37.07 17.94,36.75 17.94,29.45 20.17,27.23 29.69,27.23 34.14,31.67 34.14,31.64 | 34.14,31.64 33.96,31.47 | v14.73,66.12 18.14,66.12 C25.-
  Bottom 1.27: v42.92,30.3 42.92,32.99 C8.2
INPUT1  (via drill 0.7)
  Top 0.305: v38.5,51.53 38.64,51.53 38.64,47.39 34.17,47.39 IC8.19
  Bottom 0.305: IC15.19 38.5,51.51 v38.5,51.53
INPUT2  (via drill 0.7)
  Top 0.305: v39.7,50.07 39.7,46.76 39.6,46.67 34.21,46.67 IC8.20
  Bottom 0.305: IC15.18 37.66,50.86 38.06,50.46 39.67,50.46 v39.7,50.07
INPUT3  (via drill 0.7)
  Top 0.305: v40.94,49.03 40.94,45.82 IC8.21
  Bottom 0.305: IC15.17 37.35,50.21 38.53,49.03 v40.94,49.03
INPUT4  (via drill 0.7)
  Top 0.305: v30.62,45.03 v30.62,45.02 IC8.22
  Bottom 0.305: IC15.16 36.25,49.54 30.62,49.54 v30.62,45.03
INPUT5  (via drill 0.7)
  Top 0.305: v31.89,42.61 35.97,42.61 IC8.23
  Bottom 0.305: IC15.15 31.89,48.91 v31.89,42.61
INPUT6  (via drill 0.7)
  Top 0.305: v33.19,41.33 35.69,41.33 36.03,41.67 36.45,41.67 36.76,41.98 IC8.24
  Bottom 0.305: IC15.14 33.19,48.26 v33.19,41.33
INPUT7  (via drill 0.7)
  Top 0.305: IC8.25 37.57,41.84 v36.31,40.58
  Bottom 0.305: v36.31,40.58 34.62,40.58 34.62,47.62 IC15.13
INPUT8  (via drill 0.7)
  Top 0.305: IC8.26 38.37,45.08 v38.36,44.78
  Bottom 0.305: v38.36,44.78 38.36,46.96 IC15.12
MCLR  (via drill 0.7)
  Top 0.305: v29.33,47.65 29.91,48.22 IC8.18
  Bottom 0.305: X3.1 25.56,42.15 26.52,43.1 26.52,46.91 27.15,47.55 29.23,47.55 v29.33,47.65
N$1
  Top 0.305: IC8.31 42.37,37.61 Q1.2
  Bottom 0.305: C8.1 42.49,37.16 Q1.2
N$2
  Top 0.305: IC8.30 41.58,43.21 41.58,42.03 37.83,38.28 Q1.1
  Bottom 0.305: C11.2 Q1.1
N$3
  Bottom 0.305: R15.1 135.27,28.75 135.4,28.63 | R9.1 147.97,28.71 148.06,28.63 | R22.1 122.57,28.7 122.5,28.63 | R28.1 109.86,29.31 109.17,28.63 | R35.1 97.17,28.74 97.29,28.63 | R41.1 84.47,28.71 84.39,28.63 | R47.1 71.77,28.72 71.68,28.63 | R53.1 59.35,28.74 59.46,28.63
  Bottom 1.016: CAMDEN_2P1.P$2 60.91,10.64 B1.AC1
  Bottom 1.676: T16.A2 59.37,22.26 59.37,28.14 59.46,28.14 59.46,28.63 71.68,28.63 72.02,28.63 | 122.36,28.63 122.5,28.63 135.16,28.63 | 135.16,28.63 135.4,28.63 148.06,28.63 148.06,28.43 148.25,28.24 T2.A2 | 122.36,28.63 109.55,28.63 | 109.55,28.63 109.17,28.63 97.29,28.63 97.19,28.63 | 97.19,28.63 84.63,28.63 | 84.63,28.63 84.39,28.63 72.02,28.63 | T14.A2 72.05,28.6 72.02,28.63 | T12.A2 84.75,28.51 84.63,28.63 | T10.A2 97.45,28.37 97.19,28.63 | T8.A2 110.15,28.03 109.55,28.63 | T6.A2 122.85,28.13 122.36,28.63 | T4.A2 135.55,28.24 135.16,28.63 | T16.A2 59.43,22.18 | CAMDEN_2P1.P$2 60.91,18.64 59.35,20.19 59.35,22.25 T16.A2
N$4
  Bottom 1.016: CAMDEN_2P1.P$1 65.79,14.06 63.43,11.31 63.43,8.06 B1.AC2
N$5
  Bottom 1.016: B1.+ 72.99,9.9 R56.1
N$6
  Bottom 0.305: IC15.2 41.79,51.51 41.79,52.33 34.18,59.93 9.71,59.93 5.27,55.5 5.27,18.56 CAMDEN_8P-3.P$9 9.77,13.97
N$7
  Bottom 0.305: IC15.3 43.46,50.82 41.39,50.82 41.16,51.04 41.16,51.97 35.84,57.29 11.16,57.29 7.97,54.1 7.97,20.94 CAMDEN_8P-3.P$7
N$8
  Bottom 0.305: IC15.9 45.38,46.96 45.38,24.3 45.33,24.25 CAMDEN_8P-3.P$1
N$9
  Bottom 0.305: IC15.8 46.1,47.61 46.1,19.19 47.79,17.51 47.79,12.62 46.2,11.04 43.27,11.04 CAMDEN_8P-3.P$2
N$10
  Bottom 0.305: IC15.7 46.91,48.26 46.91,33.45 48.64,33.45 48.64,11.07 46.82,9.25 39.98,9.25 CAMDEN_8P-3.P$3
N$11
  Bottom 0.305: IC15.4 41.13,50.2 40.6,50.74 40.6,51.63 36.16,56.07 14.24,56.07 10.77,52.6 10.77,23.22 CAMDEN_8P-3.P$6 19.68,14.06
N$12
  Bottom 0.305: IC15.5 48.72,49.56 48.72,36.11 50.6,36.11 50.6,15.11 51.26,15.11 51.26,7.94 49.75,6.43 32.64,6.43 CAMDEN_8P-3.P$5
N$13
  Bottom 0.305: IC15.6 47.78,48.91 47.78,34.97 49.55,34.97 49.55,8.36 48.58,7.39 36.75,7.39 CAMDEN_8P-3.P$4
N$16
  Bottom 1.016: IC3.6 72.34,65.74 R11.2
N$17
  Bottom 1.016: IC6.6 85.04,65.74 R18.2
N$18
  Bottom 1.016: IC9.6 97.74,66.27 99.07,67.6 99.78,67.6 R24.2
N$20
  Bottom 1.016: IC2.6 148.35,34.17 146.57,32.4 145.99,32.4 R8.2
N$25
  Bottom 1.016: IC4.6 135.55,34.44 135.37,34.27 135.37,33.9 133.83,32.36 R14.2
N$27
  Bottom 1.016: IC11.6 110.44,65.82 R31.2
N$29
  Bottom 1.016: IC13.6 123.14,65.81 R37.2
N$30
  Bottom 1.016: IC16.6 135.84,65.61 R43.2
N$33
  Bottom 1.016: IC17.6 72.05,34.07 70.47,32.5 69.9,32.5 R46.2
N$34
  Bottom 1.016: IC14.6 84.75,34.17 83.17,32.6 82.7,32.6 R40.2
N$35
  Bottom 1.016: 97.45,34.54 IC12.6 97.47,34.94 97.47,34.2 95.63,32.36 R34.2
N$36
  Bottom 1.016: 110.15,34.54 IC10.6 110.07,34.89 110.07,33.9 108.53,32.36 R27.2
N$37
  Bottom 1.016: 122.85,34.54 IC7.6 122.87,34.94 122.87,34.1 121.23,32.46 R21.2
N$38
  Top 0.305: 30.29,35.43 R29.1 30.18,35.42 LED1.A
N$39
  Top 0.305: LED1.C 33.02,37.29 35.07,39.34 36.96,39.34 39.14,41.52 39.14,42.12 39.14,43.2 IC8.27
N$40
  Bottom 1.016: IC18.6 148.54,65.84 R49.2
N$41
  Bottom 1.016: IC19.6 59.35,34.05 R52.2
N$46
  Bottom 0.305: R25.1 97.7,71.33 97.77,71.48 | R19.1 84.99,71.38 85.07,71.48 | 110.34,71.48 110.44,70.78 | 123.01,71.48 R38.1 | 135.84,71.48 135.84,70.78 | 148.54,71.48 R50.1 | 59.64,71.48 R6.1
  Bottom 1.016: 135.84,70.78 R44.1 | R38.1 123.14,70.78 | 110.44,70.78 R32.1
  Bottom 1.676: R12.1 72.29,71.48 | 72.29,71.48 85.04,71.48 | 97.67,71.48 85.07,71.48 85.04,71.48 | 97.67,71.48 97.67,77.83 T7.A2 | 85.04,71.48 T5.A2 | 72.29,71.48 72.29,77.83 T3.A2 | 97.67,71.48 97.77,71.48 110.34,71.48 | 110.34,71.48 T9.A2 | 110.34,71.48 123.01,71.48 123.14,71.48 | 123.14,71.48 T11.A2 | 135.84,71.48 T13.A2 | 123.14,71.48 135.84,71.48 | 135.84,71.48 148.54,71.48 | 148.54,71.48 T15.A2 | 148.54,71.48 148.59,71.33 | 72.29,71.48 59.64,71.48 T1.A2 59.61,77.86 59.61,82.34 59.52,85.74 CAMDEN_2P2.P$2 CAMDEN_2P2.P$1
N$111
  Top 1.016: LED2.A 21.48,55.17 16.89,55.17 16.89,69.79 16.96,69.79 C23.1 19.16,77.7 IC21.IN
  Bottom 1.016: IC21.IN 19.44,79.47
  Bottom 1.27: 19.44,79.47 19.44,83.53 19.53,83.62 19.53,86.92 22.39,89.78 29.06,89.78 30.89,87.94 CAMDEN_4P-1.P$2
N$112
  Top 1.016: R54.2 19.47,57.09 LED2.C
N$115
  Top 1.016: LED3.C 26.56,60.9 R55.2
N$116
  Bottom 1.016: R56.2 78.9,10.21 78.9,14.21 82.11,14.21 D1.C 86.74,14.32 87.79,13.26 87.79,7.86 86.84,6.91 84.89,6.91 1.2
N$117
  Bottom 1.016: B1.- R57.1
N$118
  Bottom 1.016: R57.2 78.88,4.8 78.88,4.03 79.01,4.16 D1.A 82.11,9.16 84.17,9.16 1.3 84.46,10.08
N$119
  Bottom 0.813: R4.1 59.64,60.38 IC1.1
N$120
  Bottom 1.016: IC1.6 59.64,65.79 R5.2
N$121
  Bottom 0.406: R5.1 60.54,69.58 R6.2
  Bottom 1.016: R6.2 58.15,68.88 56.37,67.1 56.37,64.24 C2.1
N$123
  Top 1.016: IC1.4 64.72,77.83 T1.G
N$125
  Bottom 0.813: R10.1 72.34,60.37 IC3.1
N$127
  Bottom 0.406: R11.1 73.03,69.62 R12.2
  Bottom 1.016: R12.2 70.25,68.88 69.07,67.7 C4.1
N$129
  Top 1.016: IC3.4 77.42,77.83 T3.G
N$131
  Bottom 0.813: R17.1 85.04,60.37 IC6.1
N$133
  Bottom 0.406: R18.1 85.73,69.62 R19.2
  Bottom 1.016: R19.2 82.75,68.88 81.77,67.9 C9.1
N$135
  Top 1.016: IC6.4 90.12,77.83 T5.G
N$137
  Bottom 0.813: R23.1 97.74,60.37 IC9.1
N$139
  Bottom 0.406: R24.1 98.33,69.52 R25.2
  Bottom 1.016: R25.2 95.25,68.88 94.37,68 94.37,64.24 C12.1
N$141
  Top 1.016: IC9.4 102.82,77.83 T7.G
N$143
  Bottom 0.813: R30.1 110.44,60.37 IC11.1
N$145
  Bottom 0.406: R31.1 111.12,69.58 R32.2
  Bottom 1.016: R32.2 108.35,68.88 107.37,67.9 C14.1
N$147
  Top 1.016: T9.G 115.52,77.83 IC11.4
N$149
  Bottom 0.813: R36.1 123.14,60.37 IC13.1
N$151
  Bottom 0.406: R37.1 123.75,69.52 R38.2
  Bottom 1.016: R38.2 120.25,68.88 119.67,68.3 119.67,64.24 C17.1
N$153
  Top 1.016: T11.G 128.22,77.83 IC13.4
N$155
  Bottom 0.813: R42.1 135.84,60.37 IC16.1
N$157
  Bottom 0.406: R43.1 136.48,69.52 R44.2
  Bottom 1.016: R44.2 133.75,68.88 132.57,67.7 132.57,64.41 C19.1
N$159
  Top 1.016: T13.G 140.92,77.83 IC16.4
N$161
  Bottom 0.813: R48.1 148.54,60.37 IC18.1
N$163
  Bottom 0.406: R49.1 150.17,69.62 R50.2
  Bottom 1.016: R50.2 146.45,68.88 145.27,67.7 145.27,64.24 C21.1
N$165
  Top 1.016: T15.G 153.62,77.83 IC18.4
N$168
  Bottom 1.016: R7.1 148.25,39.72 IC2.1
N$170
  Bottom 0.406: R8.1 147.3,30.54 R9.2
  Bottom 1.016: 147.97,31.28 R9.2 150.19,31.21 151.37,32.4 151.37,35.78 C3.1
N$172
  Top 1.016: T2.G 143.17,22.26 IC2.4
N$174
  Bottom 1.016: R13.1 135.55,39.72 IC4.1
N$176
  Bottom 0.406: R15.2 134.22,31.21 R14.1
  Bottom 1.016: 135.27,31.28 R15.2 137.89,31.21 139.07,32.4 C5.1
N$178
  Top 1.016: T4.G 130.47,22.26 IC4.4
N$180
  Bottom 1.016: R20.1 122.85,39.72 IC7.1
N$182
  Bottom 0.406: R22.2 121.42,31.21 R21.1
  Bottom 1.016: 122.57,31.28 R22.2 125.19,31.21 126.37,32.4 C10.1
N$184
  Top 1.016: T6.G 117.77,22.26 IC7.4
N$186
  Bottom 1.016: R26.1 110.15,39.72 IC10.1
N$188
  Bottom 0.406: R28.2 109.77,31.1 108.6,31.1 R27.1
  Bottom 1.016: R28.2 109.87,31.28 112.75,31.28 113.77,32.3 113.77,35.74 C13.1
N$190
  Top 1.016: T8.G 105.07,22.26 IC10.4
N$192
  Bottom 1.016: R33.1 97.45,39.72 IC12.1
N$194
  Bottom 0.406: R34.1 96.42,30.46 R35.2
  Bottom 1.016: R35.2 97.17,31.28 99.75,31.28 100.97,32.5 C15.1
N$196
  Top 1.016: IC12.4 92.37,29.72 94.88,29.72 94.88,22.26 T10.G
N$198
  Bottom 1.016: R39.1 84.75,39.72 IC14.1
N$200
  Bottom 0.406: R40.1 83.72,30.46 R41.2
  Bottom 1.016: R41.2 84.47,31.28 87.25,31.28 88.27,32.3 88.27,35.8 C18.1
N$202
  Top 1.016: T12.G 79.67,22.26 IC14.4
N$204
  Bottom 1.016: R45.1 72.05,39.72 IC17.1
N$206
  Bottom 0.406: R46.1 71.12,30.56 R47.2
  Bottom 1.016: R47.2 71.77,31.28 74.45,31.28 75.67,32.5 75.67,35.73 C20.1
N$208
  Top 1.016: T14.G 66.97,22.26 IC17.4
N$210
  Bottom 1.016: R51.1 59.35,39.72 IC19.1
N$212
  Bottom 0.406: R52.1 58.77,30.26 R53.2
  Bottom 1.016: R53.2 59.35,31.28 61.45,31.28 62.77,32.6 62.77,35.75 C22.1
N$214
  Top 1.016: T16.G 54.27,22.26 IC19.4
N$217
  Top 0.61: CAN_LINE_TERM.2 44.65,73.63 R16.2
OUT1
  Top 0.305: IC18.2 151.08,44.98 47.73,44.98 47.73,44.28 45.17,41.72 43.17,41.72 IC8.32
OUT2
  Top 0.305: IC16.2 138.38,45.82 IC8.35
OUT3
  Top 0.305: IC13.2 125.68,46.62 IC8.36
OUT4
  Top 0.305: IC11.2 112.98,47.42 IC8.37
OUT5
  Top 0.305: IC9.2 100.28,51.42 IC8.42
OUT6
  Top 0.305: IC6.2 87.58,52.22 IC8.43
OUT7
  Top 0.305: IC3.2 74.88,53.02 IC8.44
OUT8
  Top 0.305: IC1.2 62.18,55.39 43.94,55.39 43.94,54.82 IC8.1
OUT9  (via drill 0.7)
  Top 0.305: v111.75,54.7 111.74,48.28 IC8.38
  Bottom 0.305: IC2.2 145.72,54.7 v111.75,54.7
OUT10  (via drill 0.7)
  Top 0.305: v109.92,52.92 109.92,49.02 IC8.39
  Bottom 0.305: IC4.2 133.02,52.92 110.83,52.92 110.73,52.92 v109.92,52.92
OUT11  (via drill 0.7)
  Top 0.305: v107.58,50.98 107.58,49.82 IC8.40
  Bottom 0.305: IC7.2 120.31,50.98 v107.58,50.98
OUT12  (via drill 0.7)
  Top 0.305: v104.78,51.68 104.78,52.17 102.48,52.17 102.48,50.62 IC8.41
  Bottom 0.305: IC10.2 107.61,45.88 104.85,45.88 104.85,51.68 v104.78,51.68
OUT13  (via drill 0.7 pad 1.02)
  Top 0.305: v40.74,62.92 40.63,62.92 40.05,62.33 40.05,59.07 40.74,58.37 40.74,54.85 IC8.5
  Bottom 0.305: IC12.2 94.91,48.36 54.24,48.36 54.24,62.92 v40.74,62.92
OUT14  (via drill 0.7)
  Top 0.305: v41.56,60.82 IC8.4
  Bottom 0.305: IC14.2 82.21,47.19 53.27,47.19 53.27,60.82 v41.56,60.82
OUT15  (via drill 0.7)
  Top 0.305: IC8.3 42.37,58.53 v42.91,59.07
  Bottom 0.305: IC17.2 69.51,46.14 52.41,46.23 52.41,59.16 v42.91,59.07
OUT16  (via drill 0.7)
  Top 0.305: v44.87,57.56 43.17,57.56 IC8.2
  Bottom 0.305: IC19.2 56.81,45.1 51.43,45.1 51.43,57.56 v44.87,57.56
OUTPUT1
  Top 1.016: T16.A1 61.89,24.85 C22.2
  Bottom 1.676: T16.A1 67.09,16.89 94.72,16.89 97.3,14.49 97.72,14.06 CAMDEN_8P-2.P$9
OUTPUT2
  Bottom 1.016: T14.A1 75.59,22.26 C20.2
  Bottom 1.676: T14.A1 77.55,19.3 99.8,19.3 102.34,16.75 107.8,16.75 110.11,14.44 CAMDEN_8P-2.P$7
OUTPUT3
  Top 1.676: T12.A1 90.89,22.26 94.18,18.97 107.11,18.97 109.39,18.97 114.3,14.06 CAMDEN_8P-2.P$6
  Bottom 1.016: T12.A1 88.29,22.26 C18.2
  Bottom 1.676: T12.A1 87.3,22.27
OUTPUT4
  Bottom 1.016: T10.A1 100.98,22.26 C15.2
  Bottom 1.676: 112.56,18.98 103.27,18.98 T10.A1 | 112.56,18.98 112.61,18.98 | CAMDEN_8P-2.P$5 119.7,14.06 117,16.75 114.79,16.75 112.56,18.98
OUTPUT5
  Bottom 1.016: T8.A1 113.69,22.26 C13.2
  Bottom 1.676: 123.04,19.02 115.93,19.02 T8.A1 | 123.04,19.02 123.31,19.02 | CAMDEN_8P-2.P$4 125.35,16.71 123.04,19.02
OUTPUT6
  Bottom 1.016: T6.A1 126.38,22.26 C10.2
  Bottom 1.676: CAMDEN_8P-2.P$3 130.43,17.22 T6.A1
OUTPUT7
  Bottom 1.016: T4.A1 139.07,22.26 C5.2
  Bottom 1.676: T4.A1 138.09,16.64 CAMDEN_8P-2.P$2
OUTPUT8
  Bottom 1.016: T2.A1 151.33,22.36 C3.2
  Bottom 1.676: T2.A1 150.79,15.21 149.64,14.06 CAMDEN_8P-2.P$1
OUTPUT9
  Top 1.016: C2.2 56.24,76.97 T1.A1
  Top 1.676: CAMDEN_8P-1.P$1 61.58,85.78 57.32,81.52 57.32,77.29 57.1,77.08 T1.A1
OUTPUT10  (via drill 0.7)
  Top 1.016: T3.A1 69.8,75.1 C4.2
  Top 1.676: CAMDEN_8P-1.P$2 107.91,86.49 104.62,89.78 v69.7,89.78
  Bottom 1.676: v69.7,89.78 69.7,77.93 T3.A1
OUTPUT11
  Top 1.016: T5.A1 82.5,75.09 C9.2
  Bottom 1.676: CAMDEN_8P-1.P$3 112.99,86.8 107.48,92.32 87.16,92.32 82.4,87.55 82.4,77.93 T5.A1
OUTPUT12
  Top 1.016: T7.A1 95.2,75.15 C12.2
  Bottom 1.676: T7.A1 95.2,79.58 96.55,80.93 106.11,80.93 108.5,83.32 116.84,83.32 116.84,85.5 CAMDEN_8P-1.P$4
OUTPUT13
  Top 1.016: C14.2 107.37,77.3 T9.A1
  Bottom 1.676: T9.A1 107.9,79.62 109.26,80.98 109.35,80.89 118.28,80.89 122.2,84.81 CAMDEN_8P-1.P$5
OUTPUT14
  Top 1.016: C17.2 119.63,76.87 T11.A1
  Bottom 1.676: 120.6,79.02 T11.A1 120.81,78.05 120.81,79.62 122.72,81.52 126.85,81.52 126.85,85.35 127.8,85.35 CAMDEN_8P-1.P$6
OUTPUT15
  Top 1.016: C19.2 132.78,77.31 T13.A1
  Bottom 1.676: CAMDEN_8P-1.P$7 133.31,77.85 T13.A1
OUTPUT16
  Top 1.016: C21.2 145.23,77.07 T15.A1
  Bottom 1.676: CAMDEN_8P-1.P$9 138.39,85.44 T15.A1
PGC
  Top 0.305: IC8.16 34.17,49.83 27.53,49.83 26.2,48.5 26.2,44.69 25.25,43.74 21.12,43.74 20.49,43.1 20.49,32.94 21.44,31.99 X3.5
PGD
  Top 0.305: IC8.17 28.28,49.02 28.28,35.03 27.79,34.53 X3.4
RS232_RX
  Top 0.305: IC8.14 31.42,51.42 30.02,52.82 15.2,52.82 X1.4
RS232_TX
  Top 0.305: IC8.15 15.2,50.62 X1.3

### Text on the board
tNames: +5V | GND | GND | +13.8 | CAN_L | CAN_H | 230AC(FASE) | OUTPUTS | 9 | 10 | 11 | 12 | 13 | 14 | 15 | 16 | CAN LINE TERM | Vin | Vrect | RX | TX | GND | RS232 | +5V | MCLR | +5V | GND | PROG | PGC | PGD | INPUTS | 1 | 2 | 3 | 4 | 5 | 6 | 7 | 8 | FASE | NEUTRAL | <--230AC | OUTPUTS | 1 | 2 | 3 | 4 | 5 | 6 | 7 | 8